# EAGLE schematic MEGA_shield_PINS (EAGLE 7.5.0)
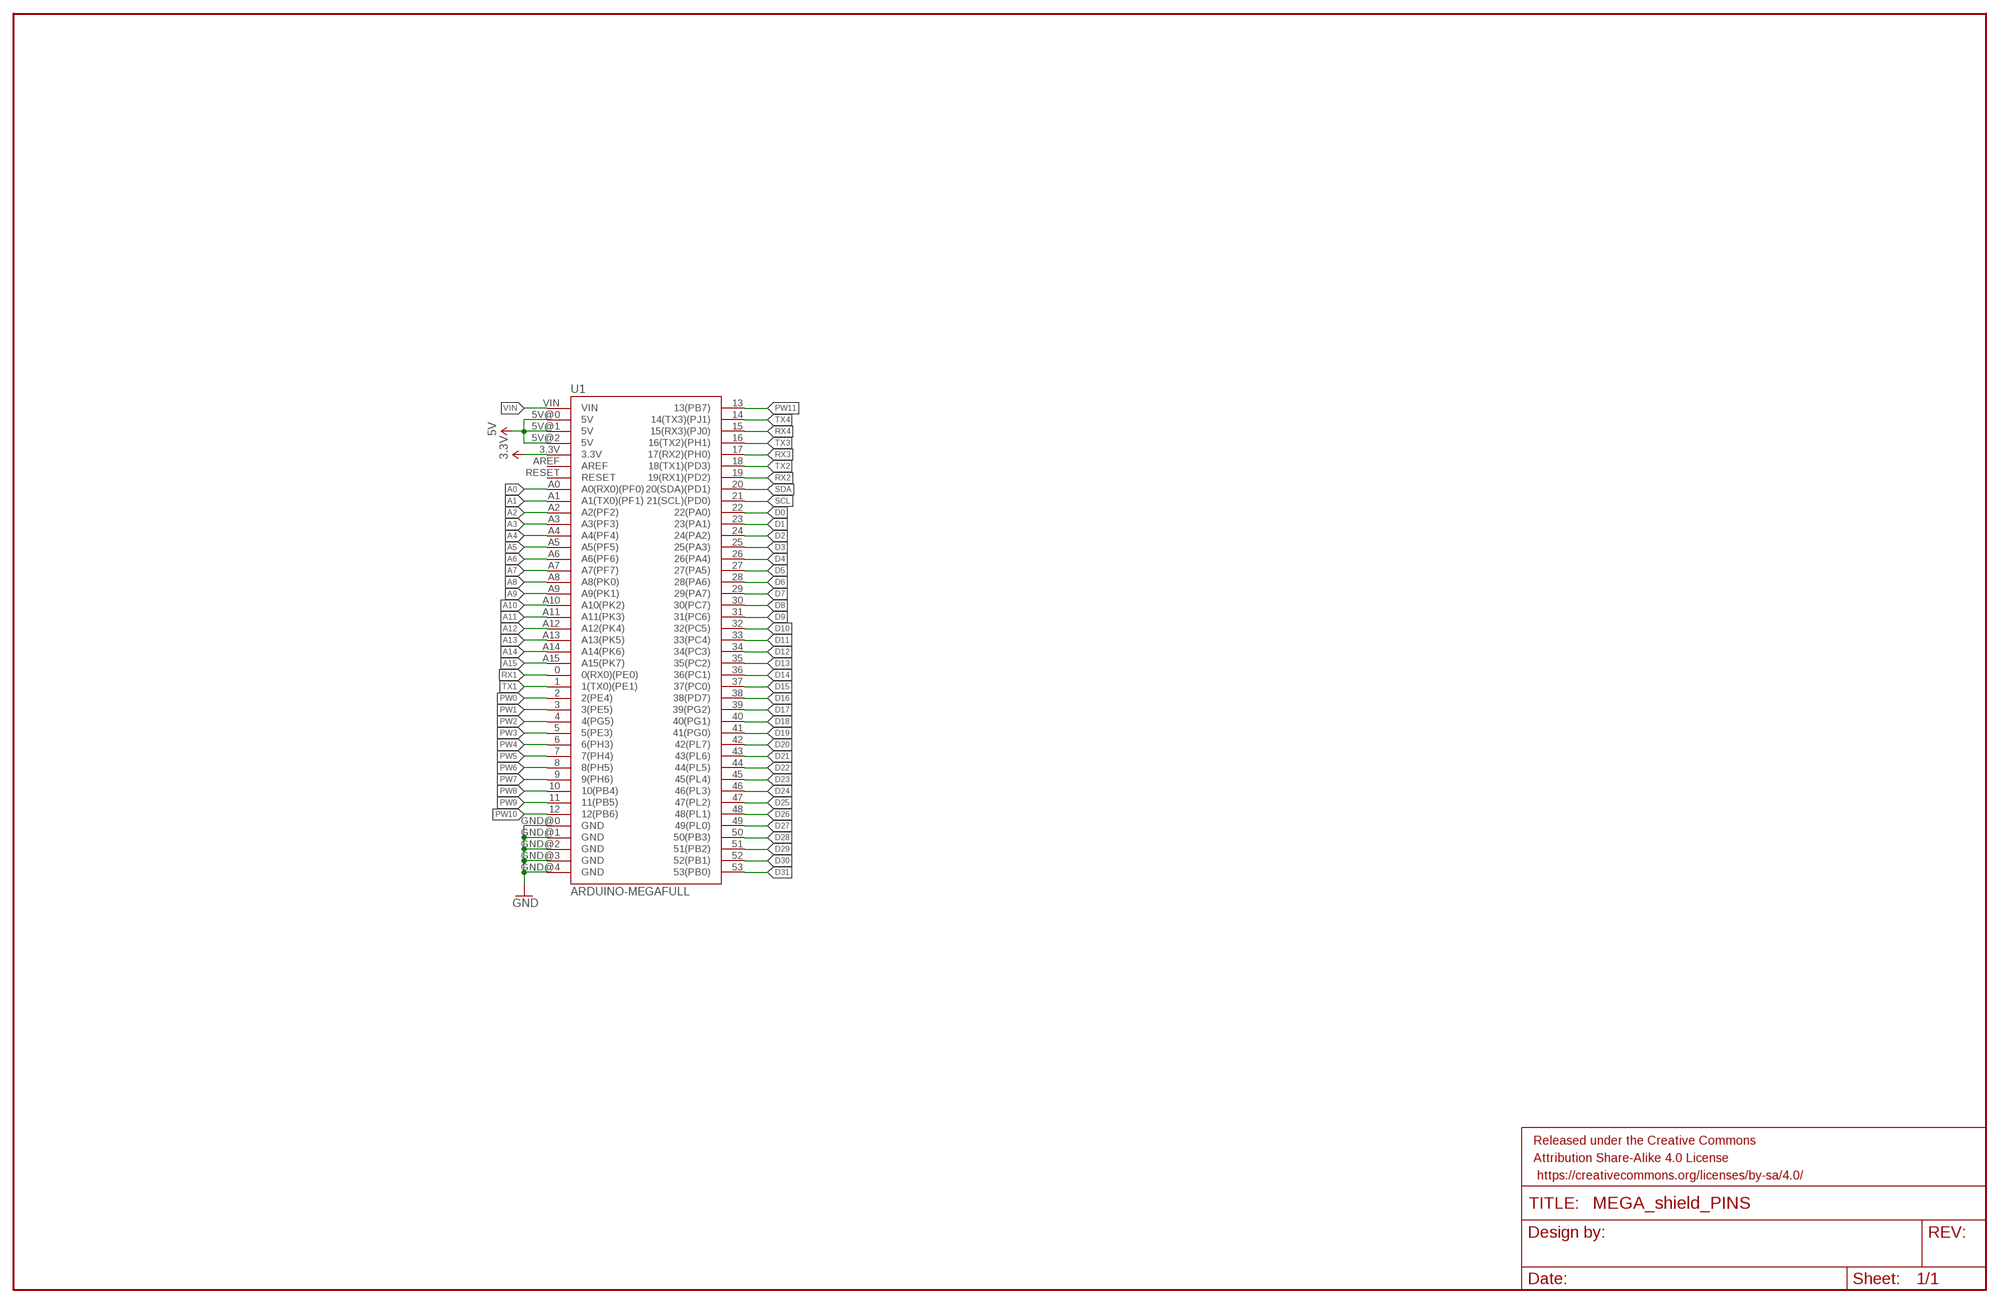
[diagram p0: schematic, sheet 1]

## Parts
FRAME1  FRAME-LEDGER  [CREATIVE_COMMONS]
U1  ARDUINO-MEGAFULL  [ARDUINO_MEGA]

## Nets
3.3V: U1.3.3V
5V: U1.5V@0(5V) U1.5V@1(5V) U1.5V@2(5V)
A0: U1.A0(A0(RX0)(PF0))
A1: U1.A1(A1(TX0)(PF1))
A2: U1.A2(A2(PF2))
A3: U1.A3(A3(PF3))
A4: U1.A4(A4(PF4))
A5: U1.A5(A5(PF5))
A6: U1.A6(A6(PF6))
A7: U1.A7(A7(PF7))
A8: U1.A8(A8(PK0))
A9: U1.A9(A9(PK1))
A10: U1.A10(A10(PK2))
A11: U1.A11(A11(PK3))
A12: U1.A12(A12(PK4))
A13: U1.A13(A13(PK5))
A14: U1.A14(A14(PK6))
A15: U1.A15(A15(PK7))
D0: U1.22(22(PA0))
D1: U1.23(23(PA1))
D2: U1.24(24(PA2))
D3: U1.25(25(PA3))
D4: U1.26(26(PA4))
D5: U1.27(27(PA5))
D6: U1.28(28(PA6))
D7: U1.29(29(PA7))
D8: U1.30(30(PC7))
D9: U1.31(31(PC6))
D10: U1.32(32(PC5))
D11: U1.33(33(PC4))
D12: U1.34(34(PC3))
D13: U1.35(35(PC2))
D14: U1.36(36(PC1))
D15: U1.37(37(PC0))
D16: U1.38(38(PD7))
D17: U1.39(39(PG2))
D18: U1.40(40(PG1))
D19: U1.41(41(PG0))
D20: U1.42(42(PL7))
D21: U1.43(43(PL6))
D22: U1.44(44(PL5))
D23: U1.45(45(PL4))
D24: U1.46(46(PL3))
D25: U1.47(47(PL2))
D26: U1.48(48(PL1))
D27: U1.49(49(PL0))
D28: U1.50(50(PB3))
D29: U1.51(51(PB2))
D30: U1.52(52(PB1))
D31: U1.53(53(PB0))
GND: U1.GND@0(GND) U1.GND@1(GND) U1.GND@2(GND) U1.GND@3(GND) U1.GND@4(GND)
PW0: U1.2(2(PE4))
PW1: U1.3(3(PE5))
PW2: U1.4(4(PG5))
PW3: U1.5(5(PE3))
PW4: U1.6(6(PH3))
PW5: U1.7(7(PH4))
PW6: U1.8(8(PH5))
PW7: U1.9(9(PH6))
PW8: U1.10(10(PB4))
PW9: U1.11(11(PB5))
PW10: U1.12(12(PB6))
PW11: U1.13(13(PB7))
RX1: U1.0(0(RX0)(PE0))
RX2: U1.19(19(RX1)(PD2))
RX3: U1.17(17(RX2)(PH0))
RX4: U1.15(15(RX3)(PJ0))
SCL: U1.21(21(SCL)(PD0))
SDA: U1.20(20(SDA)(PD1))
TX1: U1.1(1(TX0)(PE1))
TX2: U1.18(18(TX1)(PD3))
TX3: U1.16(16(TX2)(PH1))
TX4: U1.14(14(TX3)(PJ1))
VIN: U1.VIN
Unconnected: U1.AREF U1.RESET

## Library data of the parts
FRAME1 = SparkFun-Aesthetics:FRAME-LEDGER: Schematic Frame Standard 11x14 US Ledger frame
U1 = Nathans-Arduinos:ARDUINO-MEGA: Arduino Mega board footprint